# Altium schematic sheet MPU_1.SchDoc
size A3; SheetNumber: 8; SheetTotal: 8
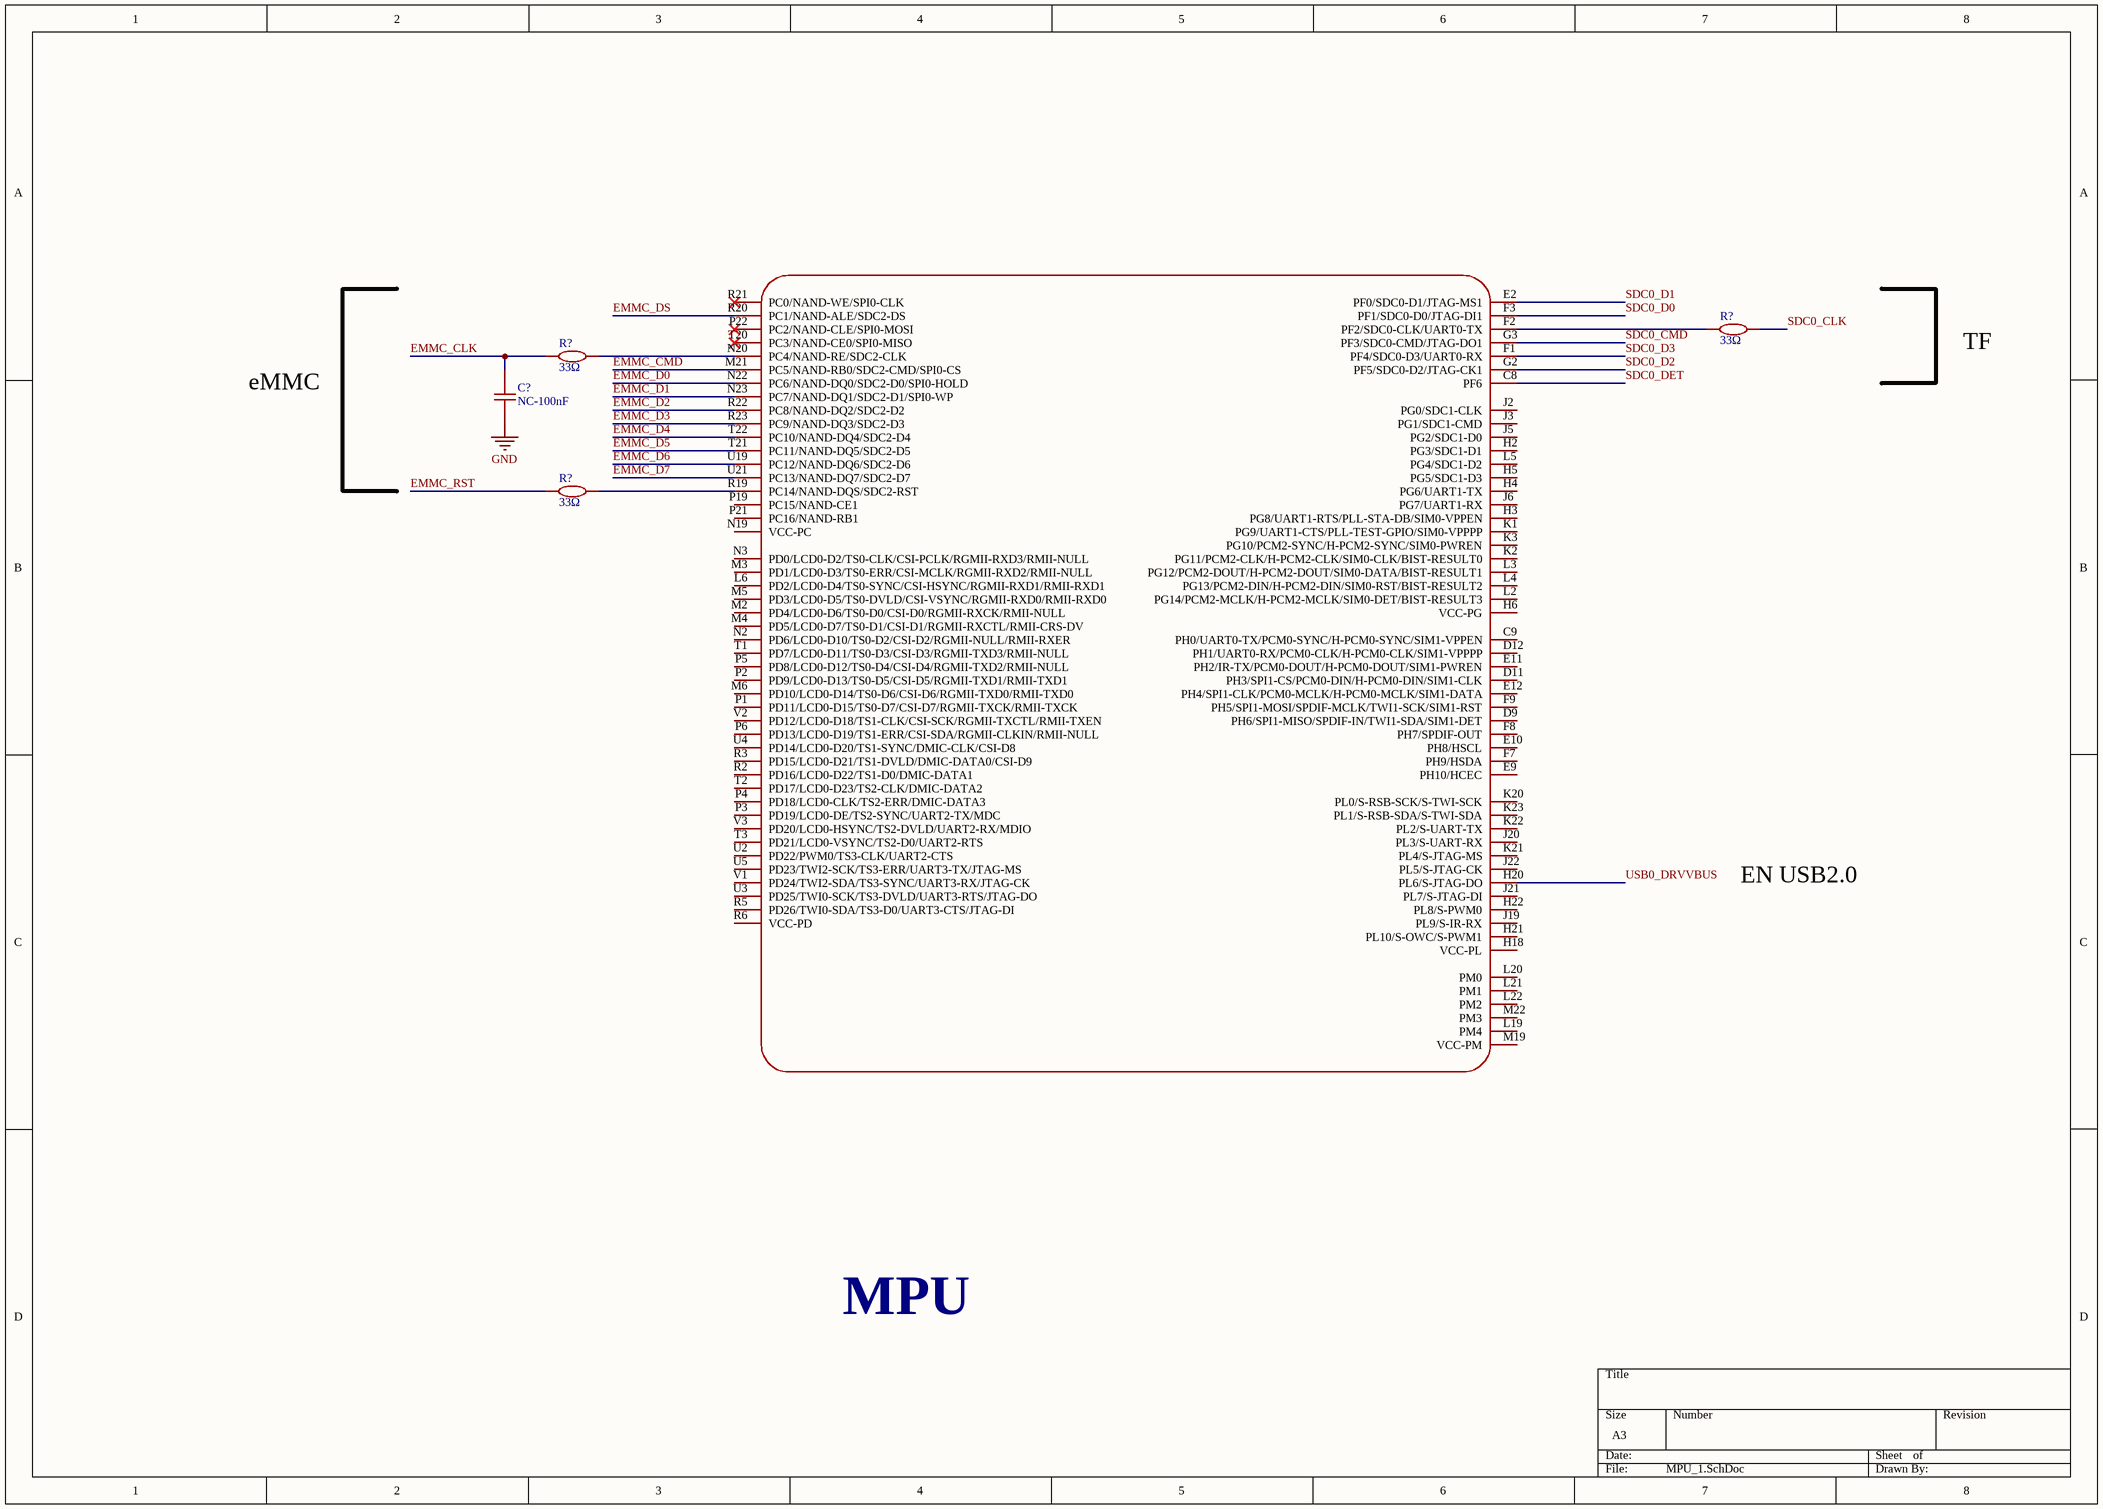
[diagram p0: MPU_1.SchDoc]

## Parts
(Parts that share a designator on the sheet are numbered #1, #2 ... from top to bottom, then left to right.)
C?  NC-100nF  [C0402]
R?#1  33Ω  [R0402]
R?#2  33Ω  [R0402]
R?#3  33Ω  [R0402]
U2  Allwinner_H6  [BGA451_ALLWINNER_H6]  (value not drawn)  (part B of 4)

## Nets
GND: C?.1
EMMC_CLK: C?.2 R?#2.1
EMMC_CMD: U2.M21(PC5/NAND-RB0/SDC2-CMD/SPI0-CS)
EMMC_D0: U2.N22(PC6/NAND-DQ0/SDC2-D0/SPI0-HOLD)
EMMC_D1: U2.N23(PC7/NAND-DQ1/SDC2-D1/SPI0-WP)
EMMC_D2: U2.R22(PC8/NAND-DQ2/SDC2-D2)
EMMC_D3: U2.R23(PC9/NAND-DQ3/SDC2-D3)
EMMC_D4: U2.T22(PC10/NAND-DQ4/SDC2-D4)
EMMC_D5: U2.T21(PC11/NAND-DQ5/SDC2-D5)
EMMC_D6: U2.U19(PC12/NAND-DQ6/SDC2-D6)
EMMC_D7: U2.U21(PC13/NAND-DQ7/SDC2-D7)
EMMC_DS: U2.R20(PC1/NAND-ALE/SDC2-DS)
EMMC_RST: R?#3.1
SDC0_CLK: R?#1.2
SDC0_CMD: U2.G3(PF3/SDC0-CMD/JTAG-DO1)
SDC0_D0: U2.F3(PF1/SDC0-D0/JTAG-DI1)
SDC0_D1: U2.E2(PF0/SDC0-D1/JTAG-MS1)
SDC0_D2: U2.G2(PF5/SDC0-D2/JTAG-CK1)
SDC0_D3: U2.F1(PF4/SDC0-D3/UART0-RX)
SDC0_DET: U2.C8(PF6)
USB0_DRVVBUS: U2.H20(PL6/S-JTAG-DO)
NetR?#1_1: R?#1.1 U2.F2(PF2/SDC0-CLK/UART0-TX)
NetR?#2_2: R?#2.2 U2.N20(PC4/NAND-RE/SDC2-CLK)
NetR?#3_2: R?#3.2 U2.R19(PC14/NAND-DQS/SDC2-RST)

Not connected (* = marked no-connect by the designer): U2 C9(PH0/UART0-TX/PCM0-SYNC/H-PCM0-SYNC/SIM1-VPPEN) D9(PH6/SPI1-MISO/SPDIF-IN/TWI1-SDA/SIM1-DET) D11(PH3/SPI1-CS/PCM0-DIN/H-PCM0-DIN/SIM1-CLK) D12(PH1/UART0-RX/PCM0-CLK/H-PCM0-CLK/SIM1-VPPPP) E9(PH10/HCEC) E10(PH8/HSCL) E11(PH2/IR-TX/PCM0-DOUT/H-PCM0-DOUT/SIM1-PWREN) E12(PH4/SPI1-CLK/PCM0-MCLK/H-PCM0-MCLK/SIM1-DATA) F7(PH9/HSDA) F8(PH7/SPDIF-OUT) F9(PH5/SPI1-MOSI/SPDIF-MCLK/TWI1-SCK/SIM1-RST) H2(PG3/SDC1-D1) H3(PG8/UART1-RTS/PLL-STA-DB/SIM0-VPPEN) H4(PG6/UART1-TX) H5(PG5/SDC1-D3) H6(VCC-PG) H18(VCC-PL) H21(PL10/S-OWC/S-PWM1) H22(PL8/S-PWM0) J2(PG0/SDC1-CLK) J3(PG1/SDC1-CMD) J5(PG2/SDC1-D0) J6(PG7/UART1-RX) J19(PL9/S-IR-RX) J20(PL3/S-UART-RX) J21(PL7/S-JTAG-DI) J22(PL5/S-JTAG-CK) K1(PG9/UART1-CTS/PLL-TEST-GPIO/SIM0-VPPPP) K2(PG11/PCM2-CLK/H-PCM2-CLK/SIM0-CLK/BIST-RESULT0) K3(PG10/PCM2-SYNC/H-PCM2-SYNC/SIM0-PWREN) K20(PL0/S-RSB-SCK/S-TWI-SCK) K21(PL4/S-JTAG-MS) K22(PL2/S-UART-TX) K23(PL1/S-RSB-SDA/S-TWI-SDA) L2(PG14/PCM2-MCLK/H-PCM2-MCLK/SIM0-DET/BIST-RESULT3) L3(PG12/PCM2-DOUT/H-PCM2-DOUT/SIM0-DATA/BIST-RESULT1) L4(PG13/PCM2-DIN/H-PCM2-DIN/SIM0-RST/BIST-RESULT2) L5(PG4/SDC1-D2) L6(PD2/LCD0-D4/TS0-SYNC/CSI-HSYNC/RGMII-RXD1/RMII-RXD1) L19(PM4) L20(PM0) L21(PM1) L22(PM2) M2(PD4/LCD0-D6/TS0-D0/CSI-D0/RGMII-RXCK/RMII-NULL) M3(PD1/LCD0-D3/TS0-ERR/CSI-MCLK/RGMII-RXD2/RMII-NULL) M4(PD5/LCD0-D7/TS0-D1/CSI-D1/RGMII-RXCTL/RMII-CRS-DV) M5(PD3/LCD0-D5/TS0-DVLD/CSI-VSYNC/RGMII-RXD0/RMII-RXD0) M6(PD10/LCD0-D14/TS0-D6/CSI-D6/RGMII-TXD0/RMII-TXD0) M19(VCC-PM) M22(PM3) N2(PD6/LCD0-D10/TS0-D2/CSI-D2/RGMII-NULL/RMII-RXER) N3(PD0/LCD0-D2/TS0-CLK/CSI-PCLK/RGMII-RXD3/RMII-NULL) N19(VCC-PC) P1(PD11/LCD0-D15/TS0-D7/CSI-D7/RGMII-TXCK/RMII-TXCK) P2(PD9/LCD0-D13/TS0-D5/CSI-D5/RGMII-TXD1/RMII-TXD1) P3(PD19/LCD0-DE/TS2-SYNC/UART2-TX/MDC) P4(PD18/LCD0-CLK/TS2-ERR/DMIC-DATA3) P5(PD8/LCD0-D12/TS0-D4/CSI-D4/RGMII-TXD2/RMII-NULL) P6(PD13/LCD0-D19/TS1-ERR/CSI-SDA/RGMII-CLKIN/RMII-NULL) P19(PC15/NAND-CE1) P21(PC16/NAND-RB1) P22(PC2/NAND-CLE/SPI0-MOSI)* R2(PD16/LCD0-D22/TS1-D0/DMIC-DATA1) R3(PD15/LCD0-D21/TS1-DVLD/DMIC-DATA0/CSI-D9) R5(PD26/TWI0-SDA/TS3-D0/UART3-CTS/JTAG-DI) R6(VCC-PD) R21(PC0/NAND-WE/SPI0-CLK)* T1(PD7/LCD0-D11/TS0-D3/CSI-D3/RGMII-TXD3/RMII-NULL) T2(PD17/LCD0-D23/TS2-CLK/DMIC-DATA2) T3(PD21/LCD0-VSYNC/TS2-D0/UART2-RTS) T20(PC3/NAND-CE0/SPI0-MISO)* U2(PD22/PWM0/TS3-CLK/UART2-CTS) U3(PD25/TWI0-SCK/TS3-DVLD/UART3-RTS/JTAG-DO) U4(PD14/LCD0-D20/TS1-SYNC/DMIC-CLK/CSI-D8) U5(PD23/TWI2-SCK/TS3-ERR/UART3-TX/JTAG-MS) V1(PD24/TWI2-SDA/TS3-SYNC/UART3-RX/JTAG-CK) V2(PD12/LCD0-D18/TS1-CLK/CSI-SCK/RGMII-TXCTL/RMII-TXEN) V3(PD20/LCD0-HSYNC/TS2-DVLD/UART2-RX/MDIO)

## Notes on the sheet
- TF
- eMMC
- EN USB2.0
- MPU

## Library data of the parts
C? = 100nF: 50V 100nF X7R ±10% 0603 Ceramic Capacitors ROHS
R?#1-R?#3 = 33Ω: 62.5mW 33Ω 50V ±100ppm/℃ Thick Film Resistor ±1% 0402 Chip Resistor - Surface Mount ROHS
U2 = Allwinner_H6: Add into BOM: yes; Symbol: Allwinner_H6; Device: Allwinner_H6; Convert to PCB: yes